# Altium schematic sheet LED´s_Valvulas.SchDoc
size A4
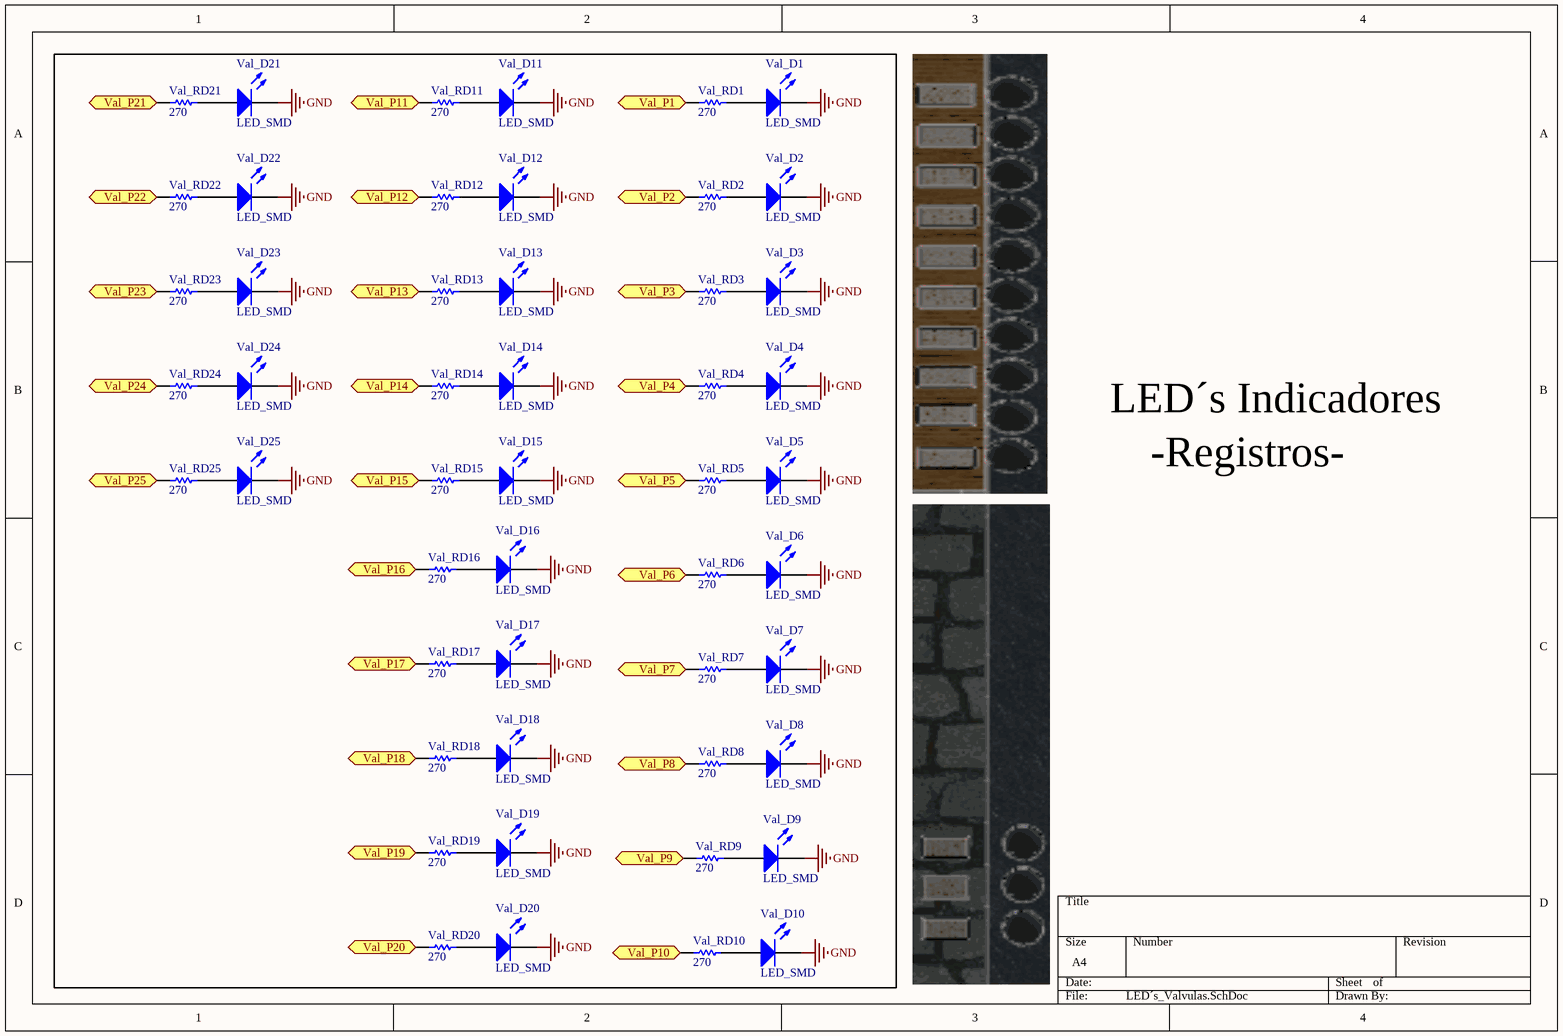
[diagram p0: LED´s_Valvulas.SchDoc]

## Parts
Val_D1  LED_SMD  [0805]
Val_D2  LED_SMD  [0805]
Val_D3  LED_SMD  [0805]
Val_D4  LED_SMD  [0805]
Val_D5  LED_SMD  [0805]
Val_D6  LED_SMD  [0805]
Val_D7  LED_SMD  [0805]
Val_D8  LED_SMD  [0805]
Val_D9  LED_SMD  [0805]
Val_D10  LED_SMD  [0805]
Val_D11  LED_SMD  [0805]
Val_D12  LED_SMD  [0805]
Val_D13  LED_SMD  [0805]
Val_D14  LED_SMD  [0805]
Val_D15  LED_SMD  [0805]
Val_D16  LED_SMD  [0805]
Val_D17  LED_SMD  [0805]
Val_D18  LED_SMD  [0805]
Val_D19  LED_SMD  [0805]
Val_D20  LED_SMD  [0805]
Val_D21  LED_SMD  [0805]
Val_D22  LED_SMD  [0805]
Val_D23  LED_SMD  [0805]
Val_D24  LED_SMD  [0805]
Val_D25  LED_SMD  [0805]
Val_RD1  value 270  [0805 Chip Res]  (hidden comment: Res Chip 0805)
Val_RD2  value 270  [0805 Chip Res]  (hidden comment: Res Chip 0805)
Val_RD3  value 270  [0805 Chip Res]  (hidden comment: Res Chip 0805)
Val_RD4  value 270  [0805 Chip Res]  (hidden comment: Res Chip 0805)
Val_RD5  value 270  [0805 Chip Res]  (hidden comment: Res Chip 0805)
Val_RD6  value 270  [0805 Chip Res]  (hidden comment: Res Chip 0805)
Val_RD7  value 270  [0805 Chip Res]  (hidden comment: Res Chip 0805)
Val_RD8  value 270  [0805 Chip Res]  (hidden comment: Res Chip 0805)
Val_RD9  value 270  [0805 Chip Res]  (hidden comment: Res Chip 0805)
Val_RD10  value 270  [0805 Chip Res]  (hidden comment: Res Chip 0805)
Val_RD11  value 270  [0805 Chip Res]  (hidden comment: Res Chip 0805)
Val_RD12  value 270  [0805 Chip Res]  (hidden comment: Res Chip 0805)
Val_RD13  value 270  [0805 Chip Res]  (hidden comment: Res Chip 0805)
Val_RD14  value 270  [0805 Chip Res]  (hidden comment: Res Chip 0805)
Val_RD15  value 270  [0805 Chip Res]  (hidden comment: Res Chip 0805)
Val_RD16  value 270  [0805 Chip Res]  (hidden comment: Res Chip 0805)
Val_RD17  value 270  [0805 Chip Res]  (hidden comment: Res Chip 0805)
Val_RD18  value 270  [0805 Chip Res]  (hidden comment: Res Chip 0805)
Val_RD19  value 270  [0805 Chip Res]  (hidden comment: Res Chip 0805)
Val_RD20  value 270  [0805 Chip Res]  (hidden comment: Res Chip 0805)
Val_RD21  value 270  [0805 Chip Res]  (hidden comment: Res Chip 0805)
Val_RD22  value 270  [0805 Chip Res]  (hidden comment: Res Chip 0805)
Val_RD23  value 270  [0805 Chip Res]  (hidden comment: Res Chip 0805)
Val_RD24  value 270  [0805 Chip Res]  (hidden comment: Res Chip 0805)
Val_RD25  value 270  [0805 Chip Res]  (hidden comment: Res Chip 0805)

## Ports
Val_P1, Val_P2, Val_P3, Val_P4, Val_P5, Val_P6, Val_P7, Val_P8, Val_P9, Val_P10, Val_P11, Val_P12, Val_P13, Val_P14, Val_P15, Val_P16, Val_P17, Val_P18, Val_P19, Val_P20, Val_P21, Val_P22, Val_P23, Val_P24, Val_P25

## Nets
GND: Val_D1.2(K) Val_D2.2(K) Val_D3.2(K) Val_D4.2(K) Val_D5.2(K) Val_D6.2(K) Val_D7.2(K) Val_D8.2(K) Val_D9.2(K) Val_D10.2(K) Val_D11.2(K) Val_D12.2(K) Val_D13.2(K) Val_D14.2(K) Val_D15.2(K) Val_D16.2(K) Val_D17.2(K) Val_D18.2(K) Val_D19.2(K) Val_D20.2(K) Val_D21.2(K) Val_D22.2(K) Val_D23.2(K) Val_D24.2(K) Val_D25.2(K)
Val_P1: Val_RD1.1 ; port Val_P1
Val_P2: Val_RD2.1 ; port Val_P2
Val_P3: Val_RD3.1 ; port Val_P3
Val_P4: Val_RD4.1 ; port Val_P4
Val_P5: Val_RD5.1 ; port Val_P5
Val_P6: Val_RD6.1 ; port Val_P6
Val_P7: Val_RD7.1 ; port Val_P7
Val_P8: Val_RD8.1 ; port Val_P8
Val_P9: Val_RD9.1 ; port Val_P9
Val_P10: Val_RD10.1 ; port Val_P10
Val_P11: Val_RD11.1 ; port Val_P11
Val_P12: Val_RD12.1 ; port Val_P12
Val_P13: Val_RD13.1 ; port Val_P13
Val_P14: Val_RD14.1 ; port Val_P14
Val_P15: Val_RD15.1 ; port Val_P15
Val_P16: Val_RD16.1 ; port Val_P16
Val_P17: Val_RD17.1 ; port Val_P17
Val_P18: Val_RD18.1 ; port Val_P18
Val_P19: Val_RD19.1 ; port Val_P19
Val_P20: Val_RD20.1 ; port Val_P20
Val_P21: Val_RD21.1 ; port Val_P21
Val_P22: Val_RD22.1 ; port Val_P22
Val_P23: Val_RD23.1 ; port Val_P23
Val_P24: Val_RD24.1 ; port Val_P24
Val_P25: Val_RD25.1 ; port Val_P25
NetVal_D1_1: Val_D1.1(A) Val_RD1.2
NetVal_D2_1: Val_D2.1(A) Val_RD2.2
NetVal_D3_1: Val_D3.1(A) Val_RD3.2
NetVal_D4_1: Val_D4.1(A) Val_RD4.2
NetVal_D5_1: Val_D5.1(A) Val_RD5.2
NetVal_D6_1: Val_D6.1(A) Val_RD6.2
NetVal_D7_1: Val_D7.1(A) Val_RD7.2
NetVal_D8_1: Val_D8.1(A) Val_RD8.2
NetVal_D9_1: Val_D9.1(A) Val_RD9.2
NetVal_D10_1: Val_D10.1(A) Val_RD10.2
NetVal_D11_1: Val_D11.1(A) Val_RD11.2
NetVal_D12_1: Val_D12.1(A) Val_RD12.2
NetVal_D13_1: Val_D13.1(A) Val_RD13.2
NetVal_D14_1: Val_D14.1(A) Val_RD14.2
NetVal_D15_1: Val_D15.1(A) Val_RD15.2
NetVal_D16_1: Val_D16.1(A) Val_RD16.2
NetVal_D17_1: Val_D17.1(A) Val_RD17.2
NetVal_D18_1: Val_D18.1(A) Val_RD18.2
NetVal_D19_1: Val_D19.1(A) Val_RD19.2
NetVal_D20_1: Val_D20.1(A) Val_RD20.2
NetVal_D21_1: Val_D21.1(A) Val_RD21.2
NetVal_D22_1: Val_D22.1(A) Val_RD22.2
NetVal_D23_1: Val_D23.1(A) Val_RD23.2
NetVal_D24_1: Val_D24.1(A) Val_RD24.2
NetVal_D25_1: Val_D25.1(A) Val_RD25.2

## Notes on the sheet
- LED´s Indicadores
- -Registros-

## Library data of the parts
Val_D1-Val_D25 = LED_SMD: LED SMD; Published: 8-Jun-2000; LatestRevisionDate: 08-Jul-2005; LatestRevisionNote: Mech Layer 1 removed.; PackageReference: LED-0; Publisher: Altium Limited
Val_RD1-Val_RD25 = Resistencia: Published: 8-Jun-2000; LatestRevisionDate: 17-Jul-2002; LatestRevisionNote: Re-released for DXP Platform.; PackageReference: AXIAL-0.3; Publisher: Altium Limited; PackageDescription: Axial Device, Thru-Hole; 2 Leads; 0.3 in Pin Spacing